# EAGLE design BMS_MCUV1.1 (EAGLE 9.2.2)

## Sheet 1 of 2
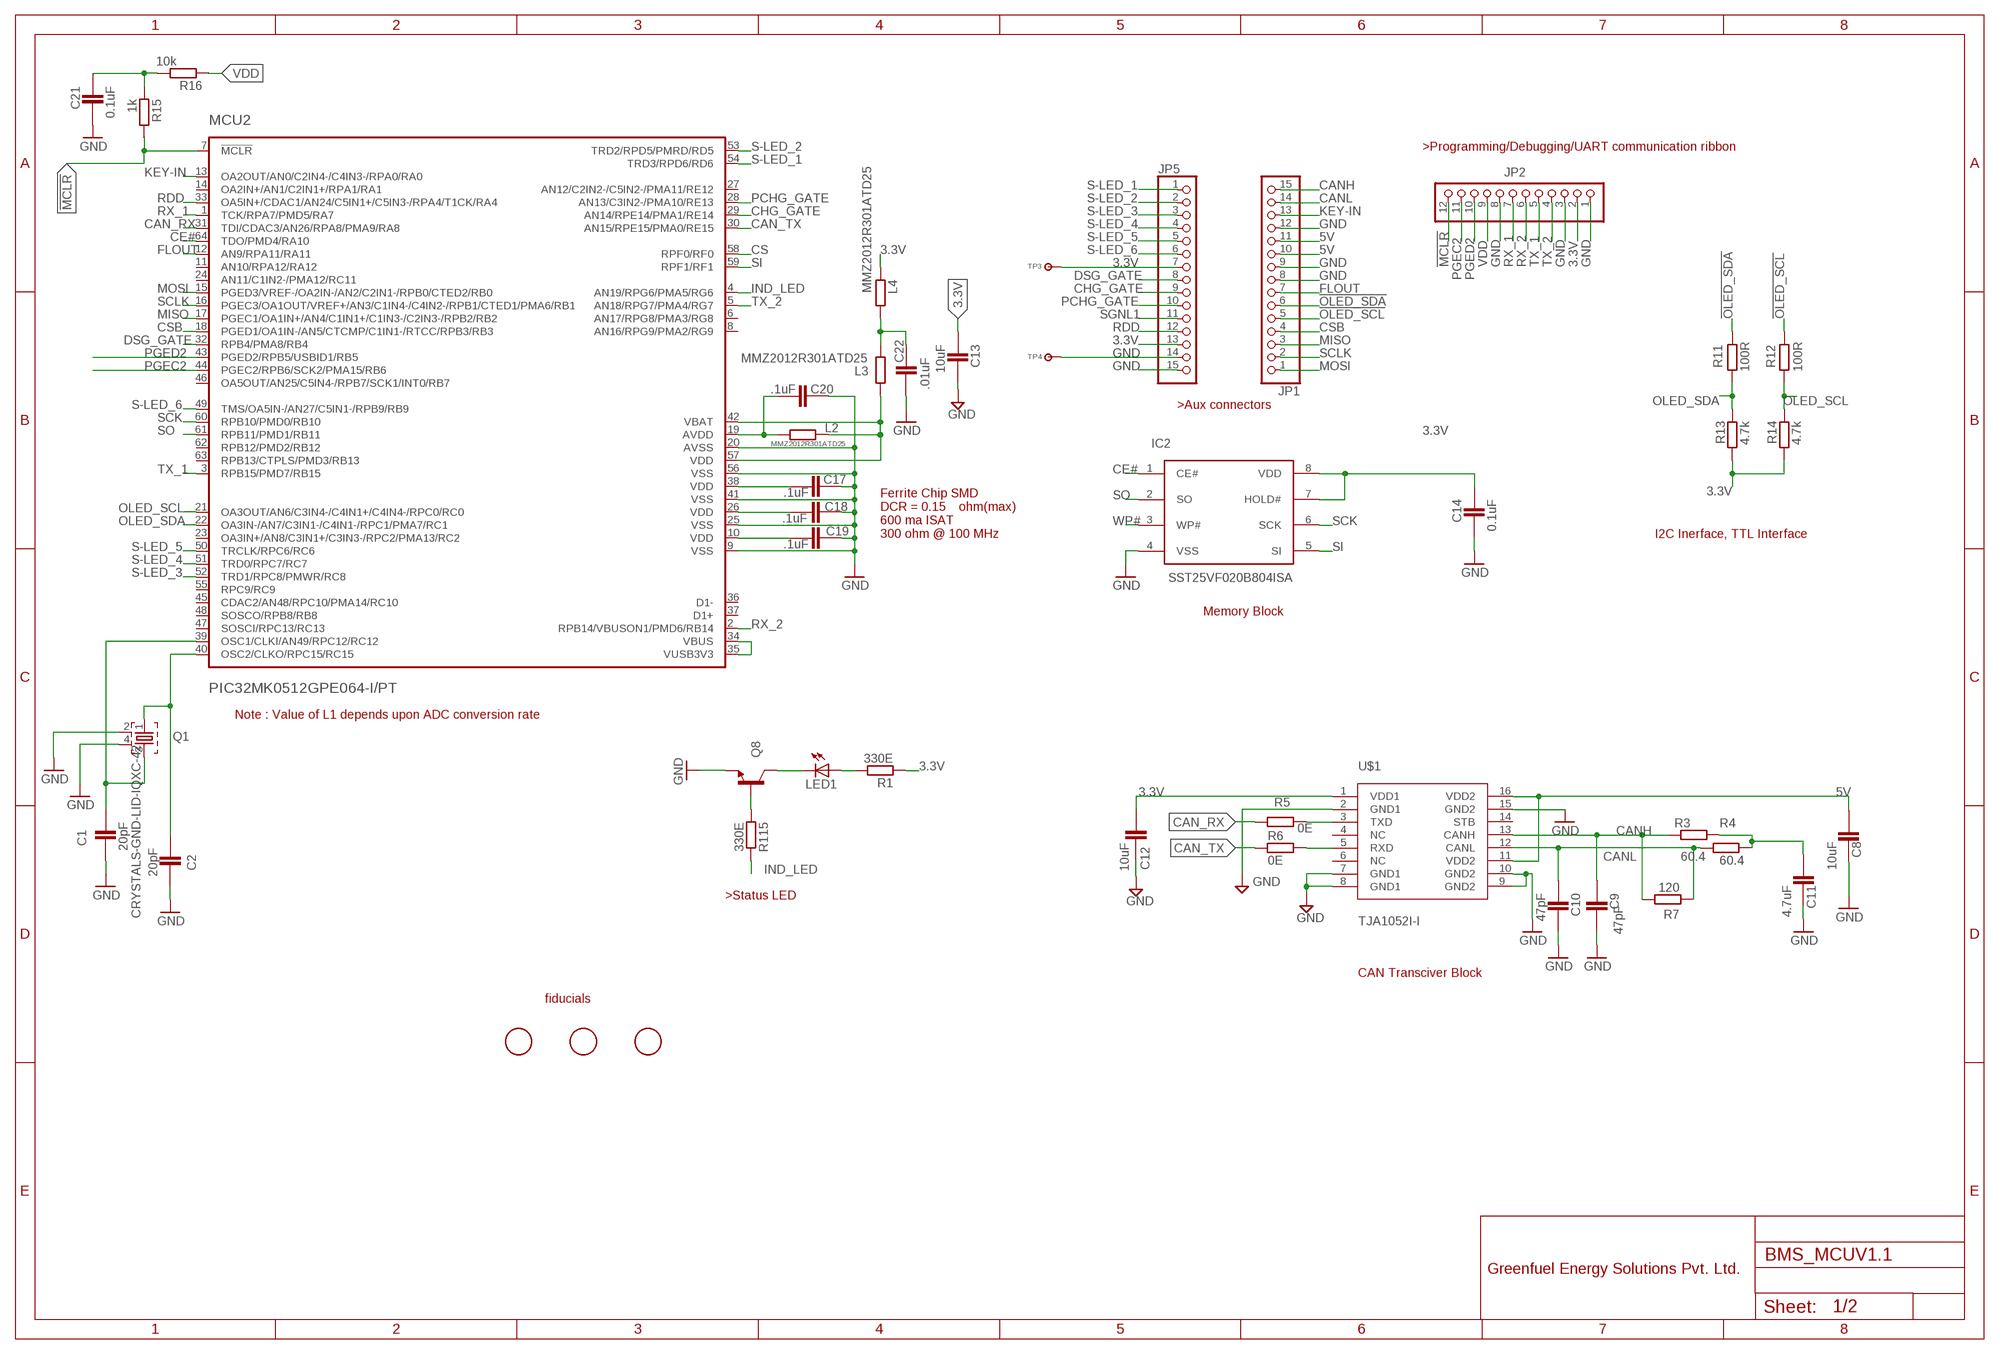
[diagram p0: schematic, sheet 1]

### Parts
C1  20pF  CAPACITOR_0402  [CAPC1005X60N]
C2  20pF  CAPACITOR_0402  [CAPC1005X60N]
C8  10uF  CAPACITOR_0402  [CAPC1005X60N]
C9  47pF  CAPACITOR_0402  [CAPC1005X60N]
C10  47pF  CAPACITOR_0402  [CAPC1005X60N]
C11  4.7uF  CAPACITOR_0402  [CAPC1005X60N]
C12  10uF  CAPACITOR_0402  [CAPC1005X60N]
C13  10uF  CAPACITOR_0402  [CAPC1005X60N]
C14  0.1uF  CAPACITOR_0402  [CAPC1005X60N]
C17  .1uF  CAPACITOR_0402  [CAPC1005X60N]
C18  .1uF  CAPACITOR_0402  [CAPC1005X60N]
C19  .1uF  CAPACITOR_0402  [CAPC1005X60N]
C20  .1uF  CAPACITOR_0402  [CAPC1005X60N]
C21  0.1uF  CAPACITOR_0402  [CAPC1005X60N]
C22  .01uF  CAPACITOR_0402  [CAPC1005X60N]
IC2  SST25VF020B804ISA  [SOIC127P600X175-8N]
JP1  PINHD-1X15  [1X15]
JP2  PINHD-1X12  [1X12X2]
JP5  PINHD-1X15  [1X15]
L2  MMZ2012R301ATD25  RESISTOR_0805  [RESC2012X70N]
L3  MMZ2012R301ATD25  RESISTOR_0805  [RESC2012X70N]
L4  MMZ2012R301ATD25  RESISTOR_0805  [RESC2012X70N]
LED1  LEDCHIP-LED0603  [CHIP-LED0603]
MCU2  PIC32MK0512GPE064-I/PT  [TQFP-64-I/PT]
Q1  CRYSTALS-GND-LID-IQXC-42  [1.4X1.2-4-PAD]
Q8  NPN_SOT-23  [SOT95P280X135-3N]
R1  330E  RESISTOR_0402  [RESC1005X40AN]
R3  60.4  RESISTOR_0402  [RESC1005X40AN]
R4  60.4  RESISTOR_0402  [RESC1005X40AN]
R5  0E  RESISTOR_0402  [RESC1005X40AN]
R6  0E  RESISTOR_0402  [RESC1005X40AN]
R7  120  RESISTOR_0402  [RESC1005X40AN]
R11  100R  RESISTOR_0402  [RESC1005X40AN]
R12  100R  RESISTOR_0402  [RESC1005X40AN]
R13  4.7k  RESISTOR_0402  [RESC1005X40AN]
R14  4.7k  RESISTOR_0402  [RESC1005X40AN]
R15  1k  RESISTOR_0402  [RESC1005X40AN]
R16  10k  RESISTOR_0402  [RESC1005X40AN]
R115  330E  RESISTOR_0402  [RESC1005X40AN]
TP3  TP-SMD60  [TP-SMD60]
TP4  TP-SMD60  [TP-SMD60]
U$1  TJA1052I-I  [SOT162-1]
U$2  FIDUCIAL  [FIDUCIAL_1MM]
U$3  FIDUCIAL  [FIDUCIAL_1MM]
U$4  FIDUCIAL  [FIDUCIAL_1MM]

### Nets
3.3V: C12.1 C13.1 C14.1 IC2.7(HOLD#) IC2.8(VDD) JP2.2 JP5.7 JP5.13 L4.1 R1.1 R13.1 R14.1 TP3.P$1 U$1.1(VDD1)
5V: C8.1 JP1.10 JP1.11 U$1.11(VDD2) U$1.16(VDD2)
!MCLR: JP2.12 MCU2.7(!MCLR) R15.2
!OLED_SCL: JP1.5 R12.2
!OLED_SDA: JP1.6 R11.2
AVDD: C20.1 L2.1 MCU2.19(AVDD)
CAN_RX: MCU2.31(TDI/CDAC3/AN26/RPA8/PMA9/RA8) R5.1
CAN_TX: MCU2.30(AN15/RPE15/PMA0/RE15) R6.1
CANH: C9.1 JP1.15 R3.1 R7.2 U$1.13(CANH)
CANL: C10.1 JP1.14 R4.1 R7.1 U$1.12(CANL)
CE#: IC2.1(CE#) MCU2.64(TDO/PMD4/RA10)
CHG_GATE: JP5.9 MCU2.29(AN14/RPE14/PMA1/RE14)
CS: MCU2.58(RPF0/RF0)
CSB: JP1.4 MCU2.18(PGED1/OA1IN-/AN5/CTCMP/C1IN1-/RTCC/RPB3/RB3)
DSG_GATE: JP5.8 MCU2.32(RPB4/PMA8/RB4)
FLOUT: JP1.7 MCU2.12(AN9/RPA11/RA11)
GND: C1.2 C2.2 C8.2 C9.2 C10.2 C11.2 C12.2 C13.2 C14.2 C17.2 C18.2 C19.2 C20.2 C21.2 C22.1 IC2.4(VSS) JP1.8 JP1.9 JP1.12 JP2.1 JP2.3 JP2.8 JP5.14 JP5.15 MCU2.9(VSS) MCU2.20(AVSS) MCU2.25(VSS) MCU2.41(VSS) MCU2.56(VSS) Q1.2 Q1.4 Q8.2(E) TP4.P$1 U$1.2(GND1) U$1.7(GND1) U$1.8(GND1) U$1.9(GND2) U$1.10(GND2) U$1.15(GND2)
IND_LED: MCU2.4(AN19/RPG6/PMA5/RG6) R115.2
KEY-IN: JP1.13 MCU2.13(OA2OUT/AN0/C2IN4-/C4IN3-/RPA0/RA0)
MISO: JP1.3 MCU2.17(PGEC1/OA1IN+/AN4/C1IN1+/C1IN3-/C2IN3-/RPB2/RB2)
MOSI: JP1.1 MCU2.15(PGED3/VREF-/OA2IN-/AN2/C2IN1-/RPB0/CTED2/RB0)
N$1: C1.1 MCU2.39(OSC1/CLKI/AN49/RPC12/RC12) Q1.3
N$2: C2.1 MCU2.40(OSC2/CLKO/RPC15/RC15) Q1.1
N$3: R5.2 U$1.3(TXD)
N$5: LED1.A R1.2
N$6: R6.2 U$1.5(RXD)
N$7: Q8.1(B) R115.1
N$8: LED1.C Q8.3(C)
N$33: C22.2 L3.2 L4.2
N$34: C21.1 R15.1 R16.2
N$82: MCU2.34(VBUS) MCU2.35(VUSB3V3)
OLED_SCL: MCU2.21(OA3OUT/AN6/C3IN4-/C4IN1+/C4IN4-/RPC0/RC0) R12.1 R14.2
OLED_SDA: MCU2.22(OA3IN-/AN7/C3IN1-/C4IN1-/RPC1/PMA7/RC1) R11.1 R13.2
PCHG_GATE: JP5.10 MCU2.28(AN13/C3IN2-/PMA10/RE13)
PGEC2: JP2.11 MCU2.44(PGEC2/RPB6/SCK2/PMA15/RB6)
PGED2: JP2.10 MCU2.43(PGED2/RPB5/USBID1/RB5)
R4/R3/C11: C11.1 R3.2 R4.2
RDD: JP5.12 MCU2.33(OA5IN+/CDAC1/AN24/C5IN1+/C5IN3-/RPA4/T1CK/RA4)
RX_1: JP2.7 MCU2.1(TCK/RPA7/PMD5/RA7)
RX_2: JP2.6 MCU2.2(RPB14/VBUSON1/PMD6/RB14)
S-LED_1: JP5.1 MCU2.54(TRD3/RPD6/RD6)
S-LED_2: JP5.2 MCU2.53(TRD2/RPD5/PMRD/RD5)
S-LED_3: JP5.3 MCU2.52(TRD1/RPC8/PMWR/RC8)
S-LED_4: JP5.4 MCU2.51(TRD0/RPC7/RC7)
S-LED_5: JP5.5 MCU2.50(TRCLK/RPC6/RC6)
S-LED_6: JP5.6 MCU2.49(TMS/OA5IN-/AN27/C5IN1-/RPB9/RB9)
SCK: IC2.6(SCK) MCU2.60(RPB10/PMD0/RB10)
SCLK: JP1.2 MCU2.16(PGEC3/OA1OUT/VREF+/AN3/C1IN4-/C4IN2-/RPB1/CTED1/PMA6/RB1)
SGNL1: JP5.11
SI: IC2.5(SI) MCU2.59(RPF1/RF1)
SO: IC2.2(SO) MCU2.61(RPB11/PMD1/RB11)
TX_1: JP2.5 MCU2.3(RPB15/PMD7/RB15)
TX_2: JP2.4 MCU2.5(AN18/RPG7/PMA4/RG7)
VDD: C17.1 C18.1 C19.1 JP2.9 L2.2 L3.1 MCU2.10(VDD) MCU2.26(VDD) MCU2.38(VDD) MCU2.42(VBAT) MCU2.57(VDD) R16.1
WP#: IC2.3(WP#)
Unconnected: MCU2.6(AN17/RPG8/PMA3/RG8) MCU2.8(AN16/RPG9/PMA2/RG9) MCU2.11(AN10/RPA12/RA12) MCU2.14(OA2IN+/AN1/C2IN1+/RPA1/RA1) MCU2.23(OA3IN+/AN8/C3IN1+/C3IN3-/RPC2/PMA13/RC2) MCU2.24(AN11/C1IN2-/PMA12/RC11) MCU2.27(AN12/C2IN2-/C5IN2-/PMA11/RE12) MCU2.36(D1-) MCU2.37(D1+) MCU2.45(CDAC2/AN48/RPC10/PMA14/RC10) MCU2.46(OA5OUT/AN25/C5IN4-/RPB7/SCK1/INT0/RB7) MCU2.47(SOSCI/RPC13/RC13) MCU2.48(SOSCO/RPB8/RB8) MCU2.55(RPC9/RC9) MCU2.62(RPB12/PMD2/RB12) MCU2.63(RPB13/CTPLS/PMD3/RB13) U$1.4(NC) U$1.6(NC) U$1.14(STB)

### Notes on the sheet
- >Programming/Debugging/UART communication ribbon
- >Aux connectors
- Ferrite Chip SMD
  DCR = 0.15ȍ ohm(max)
  600 ma ISAT
  300 ohm @ 100 MHz
- I2C Inerface, TTL Interface
- Memory Block
- Note : Value of L1 depends upon ADC conversion rate
- >Status LED
- CAN Transciver Block
- fiducials
- Greenfuel Energy Solutions Pvt. Ltd.

## Sheet 2 of 2

## Library data of the parts
C1 C2 C8-C14 C17-C22 = ipc-7351-capacitor:CAPACITOR_
IC2 = GreenFuel:SST25VF020B804ISA
JP1 JP5 = GreenFuel:PINHD-1X15: PIN HEADER
JP2 = GreenFuel:PINHD-1X12: PIN HEADER
L2-L4 R1 R3-R7 R11-R16 R115 = ipc-7351-resistor:RESISTOR_
LED1 = adafruit:LED: LED OSRAM: - CHIPLED LG R971, LG N971, LY N971, LG Q971, LY Q971, LO R971, LY R971 LH N974, LH R974 LS Q976, LO Q976, LY Q976 LO Q996 - Hyper CHIPLED LW Q18S LB Q993, LB Q99A, LB R99A - SideLED LS A670, LO A670, LY A670, LG A670, LP A670 LB A673, LV A673, LT A673, LW A673 LH A674 LY A675 LS A676, LA A676, LO A676, LY A676, LW A676 LS A679, LY A679, LG A679 - Hyper Micro SIDELED® LS Y876, LA Y876, LO Y876, LY Y876 LT Y87S - SmartLED LW L88C, LW L88S LB L89C, LB L89S, LG L890 LS L89K, LO L89K, LY L89K LS L896, LA L896, LO L896, LY L896 - TOPLED LS T670, LO T670, LY T670, LG T670, LP T670 LSG T670, LSP T670, LSY T670, LOP T670, LYG T670 LG T671, LOG T671, LSG T671 LB T673, LV T673, LT T673, LW T673 LH T674 LS T676, LA T676, LO T676, LY T676, LB T676, LH T676, LSB T676, LW T676 LB T67C, LV T67C, LT T67C, LS T67K, LO T67K, LY T67K, LW E67C LS E67B, LA E67B, LO E67B, LY E67B, LB E67C, LV E67C, LT E67C LW T67C LS T679, LY T679, LG T679 LS T770, LO T770, LY T770, LG T770, LP T770 LB T773, LV T773, LT T773, LW T773 LH T774 LS E675, LA E675, LY E675, LS T675 LS T776, LA T776, LO T776, LY T776, LB T776 LHGB T686 LT T68C, LB T68C - Hyper Mini TOPLED® LB M676 - Mini TOPLED Santana® LG M470 LS M47K, LO M47K, LY M47K Source: http://www.osram.convergy.de/
MCU2 = GreenFuel:PIC32MK0512GPE064-I/PT
Q1 = GreenFuel:CRYSTALS-GND-LID: CRYSTALS WITH CAN GROUNDED
Q8 = ipc-7351-transistor:NPN_
TP3 TP4 = simpa:TP
U$1 = GreenFuel:TJA1052I: TJA1052i - Galvanically isolated high-speed CAN transceiver Specification : Type : SOT162-1 Manufacture : NXP Manufacture PN: TJA1052i Certifications: ISO 11898-2:2003 compliant Suitable for use in 12 V and 24 V systems; compatible with 3 V to 5 V microcontrollers Supporting Material TJA1052i Datasheet <https://www.nxp.com/docs/en/data-sheet/TJA1052I.pdf>
U$2-U$4 = adafruit:FIDUCIAL: For use by pick and place machines to calibrate the vision/machine, 1mm By microbuilder.eu

## Board
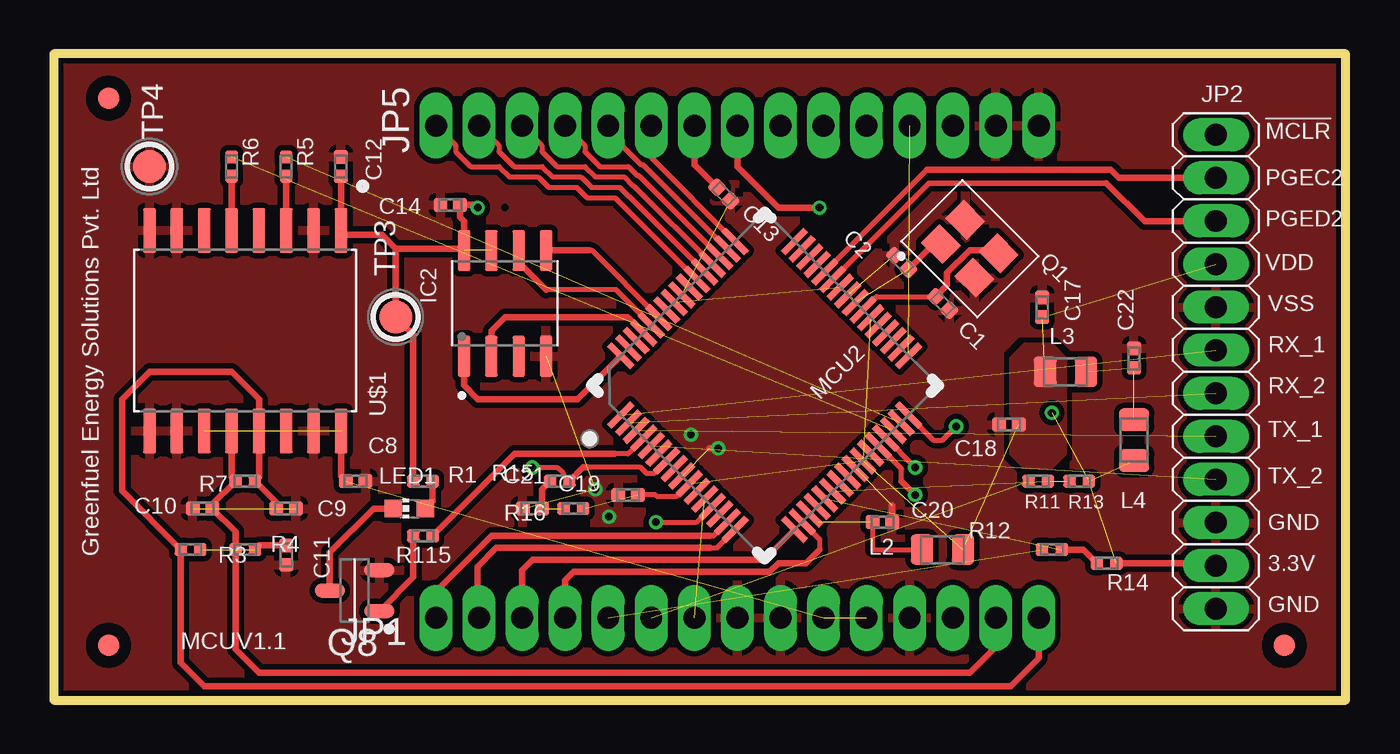
[diagram p1: board, top side]
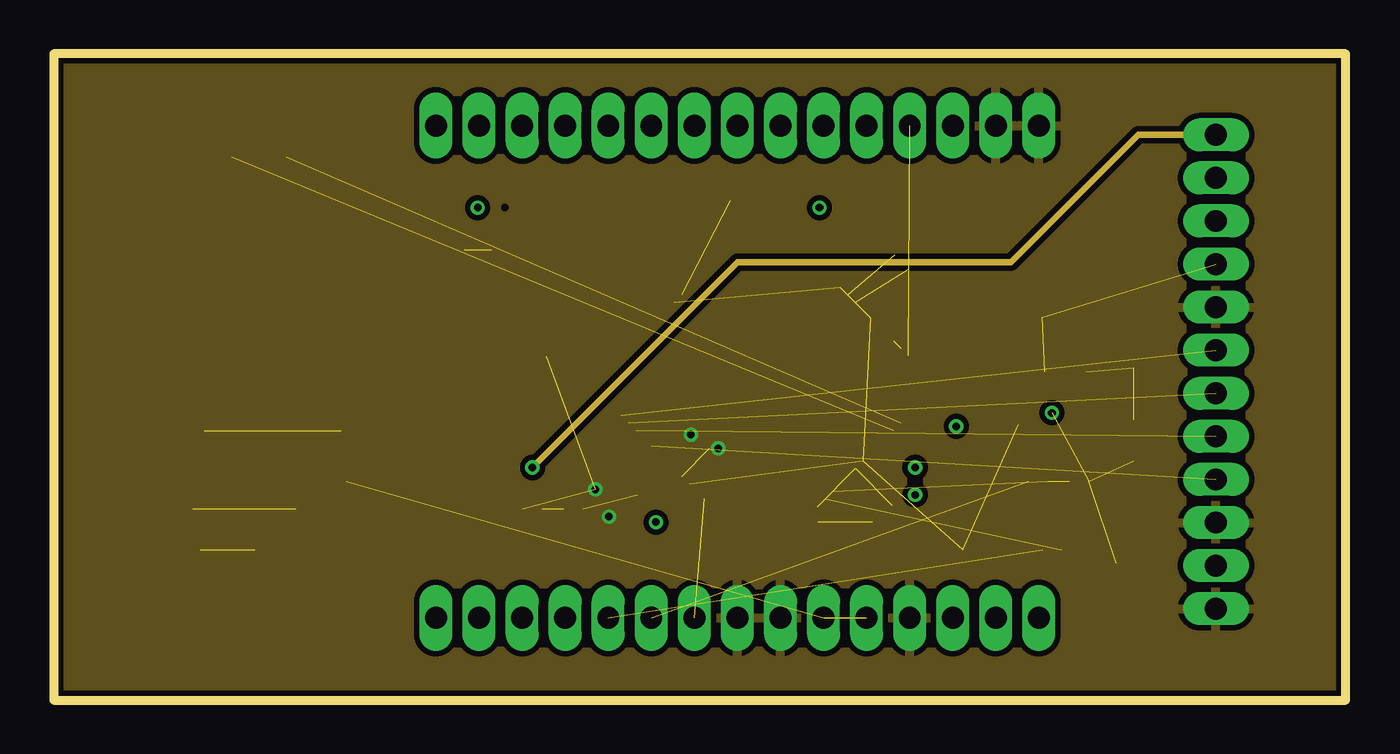
[diagram p2: board, inner layer GND]
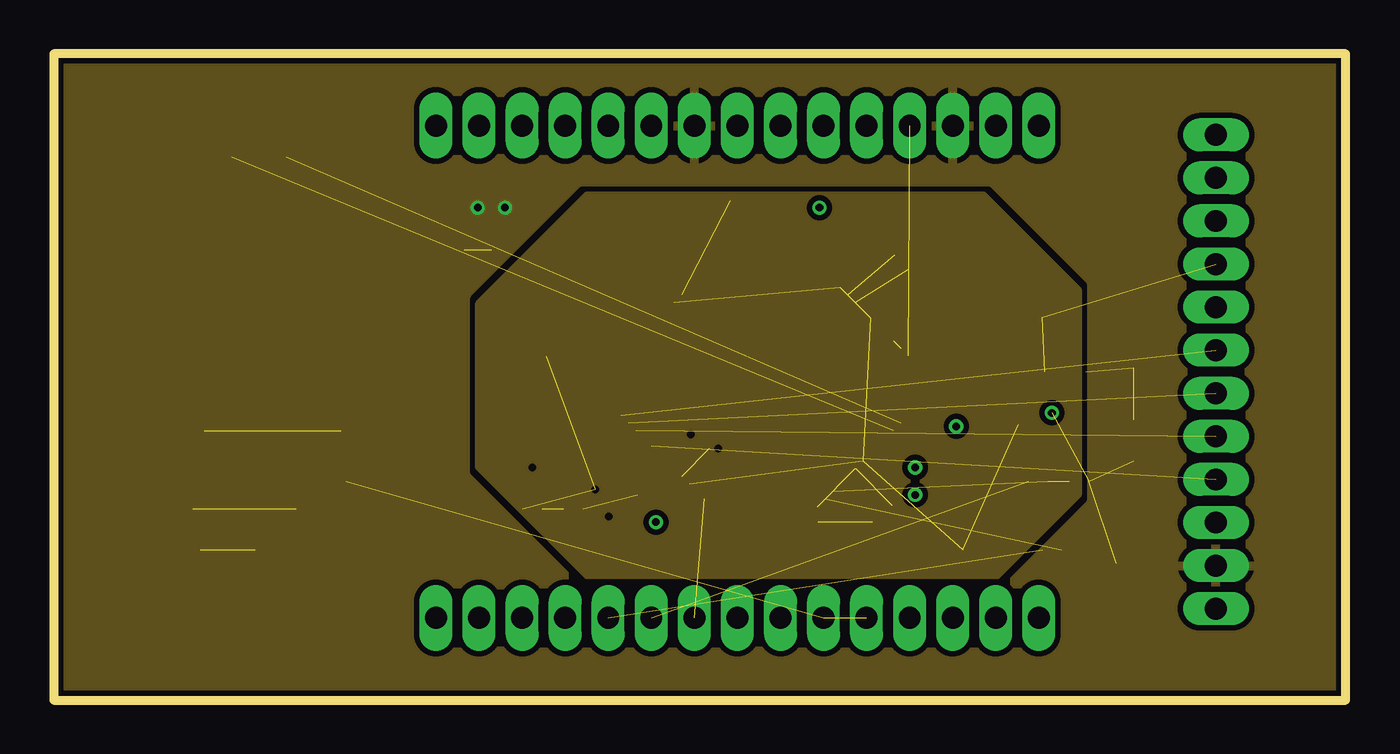
[diagram p3: board, inner layer SUPPLY]
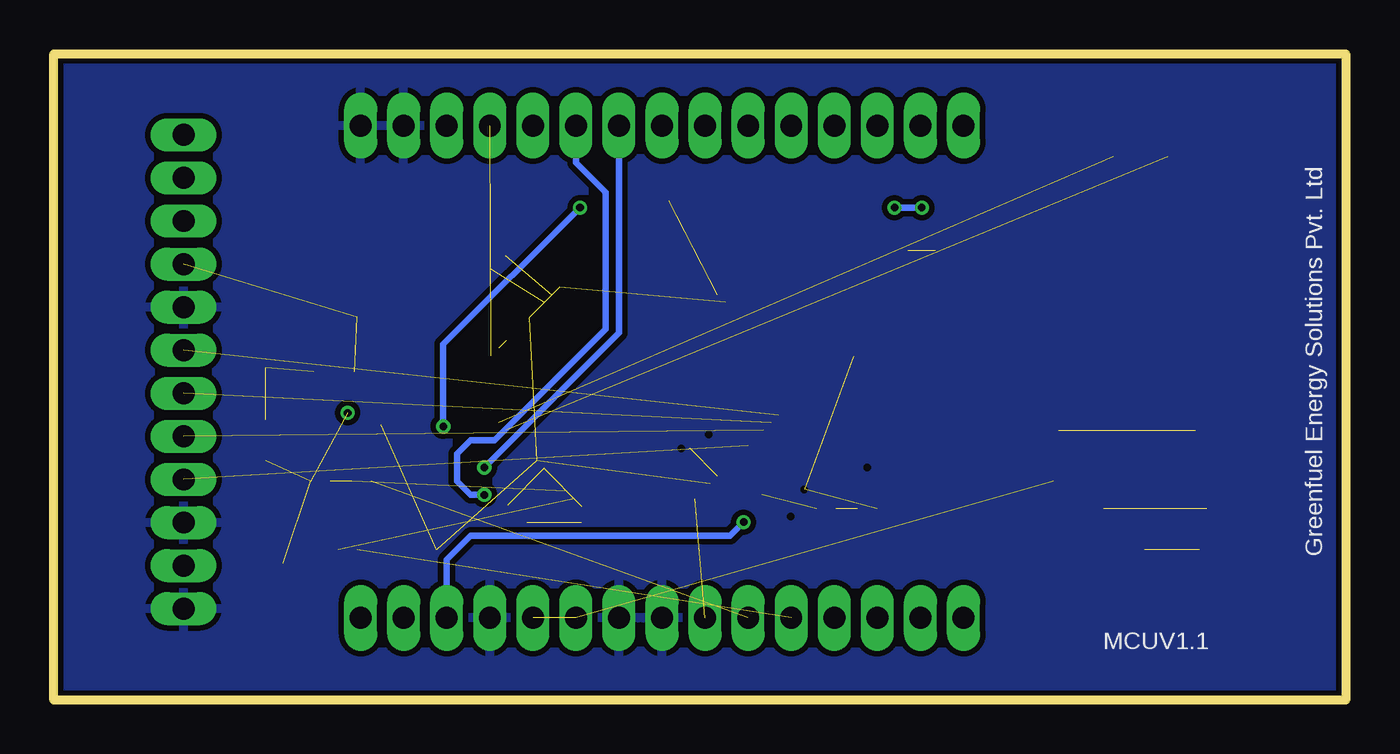
[diagram p4: board, bottom side, seen from below]

Size 60 x 30 mm. Coordinates in mm from the lower left corner, seen from the top.
Outline: 0,0 60,0 60,30 0,30 0,0
Copper layers ([2:1+2*15+16:15]): Top 0.035mm / dielectric 0.09238125mm / GND 0.035mm / dielectric 1.2304mm / SUPPLY 0.035mm / dielectric 0.09238125mm / Bottom 0.035mm
Design rules "default *": minimum track width 6mil, minimum drill 12mil, track to track 10mil, track to pad 8mil, pad to pad 6mil, via to via 10mil, smd to smd 0mil, copper to edge 10mil, drill to drill 10mil, minimum pad ring 10mil, minimum via ring 6mil, stop-mask expansion 2mil, vias tented up to drill 100mil, thermal gap 10mil

### Footprints (pad centres in the part's own frame; a part is rotated, then mirrored left to right if it is on the bottom)
CAPC1005X60N = smd 0.65 x 0.65: 1 -0.45,0; 2 0.45,0
SOIC127P600X175-8N = smd 1.9 x 0.6: 1 -2.455,1.905; 2 -2.455,0.635; 3 -2.455,-0.635; 4 -2.455,-1.905; 5 2.455,-1.905; 6 2.455,-0.635; 7 2.455,0.635; 8 2.455,1.905
1X15 = drill 1.016 long: 1 -14,0; 2 -12,0; 3 -10,0; 4 -8,0; 5 -6,0; 6 -4,0; 7 -2,0; 8 0,0; 9 2,0; 10 4,0; 11 6,0; 12 8,0; 13 10,0; 14 12,0; 15 14,0
1X12X2 = drill 1.016 long: 1 -11,0; 2 -9,0; 3 -7,0; 4 -5,0; 5 -3,0; 6 -1,0; 7 1,0; 8 3,0; 9 5,0; 10 7,0; 11 9,0; 12 11,0
RESC2012X70N = smd 1.05 x 1.4: 1 -0.95,0; 2 0.95,0
CHIP-LED0603 = smd 0.8 x 0.8: A 0,-0.75; C 0,0.75
TQFP-64-I/PT = smd 1.5 x 0.3: 1 -5.7,3.75; 2 -5.7,3.25; 3 -5.7,2.75; 4 -5.7,2.25; 5 -5.7,1.75; 6 -5.7,1.25; 7 -5.7,0.75; 8 -5.7,0.25; 9 -5.7,-0.25; 10 -5.7,-0.75; 11 -5.7,-1.25; 12 -5.7,-1.75; 13 -5.7,-2.25; 14 -5.7,-2.75; 15 -5.7,-3.25; 16 -5.7,-3.75; 33 5.7,-3.75; 34 5.7,-3.25; 35 5.7,-2.75; 36 5.7,-2.25; 37 5.7,-1.75; 38 5.7,-1.25; 39 5.7,-0.75; 40 5.7,-0.25; 41 5.7,0.25; 42 5.7,0.75; 43 5.7,1.25; 44 5.7,1.75; 45 5.7,2.25; 46 5.7,2.75; 47 5.7,3.25; 48 5.7,3.75 | smd 0.3 x 1.5: 17 -3.75,-5.7; 18 -3.25,-5.7; 19 -2.75,-5.7; 20 -2.25,-5.7; 21 -1.75,-5.7; 22 -1.25,-5.7; 23 -0.75,-5.7; 24 -0.25,-5.7; 25 0.25,-5.7; 26 0.75,-5.7; 27 1.25,-5.7; 28 1.75,-5.7; 29 2.25,-5.7; 30 2.75,-5.7; 31 3.25,-5.7; 32 3.75,-5.7; 49 3.75,5.7; 50 3.25,5.7; 51 2.75,5.7; 52 2.25,5.7; 53 1.75,5.7; 54 1.25,5.7; 55 0.75,5.7; 56 0.25,5.7; 57 -0.25,5.7; 58 -0.75,5.7; 59 -1.25,5.7; 60 -1.75,5.7; 61 -2.25,5.7; 62 -2.75,5.7; 63 -3.25,5.7; 64 -3.75,5.7
1.4X1.2-4-PAD = smd 1.4 x 1.2: 1 -1.1,-0.8; 2 1.1,-0.8; 3 1.1,0.8; 4 -1.1,0.8
SOT95P280X135-3N = smd 1.4 x 0.65: 1 -1.15,0.95; 2 -1.15,-0.95; 3 1.15,0
RESC1005X40AN = smd 0.6 x 0.6: 1 -0.45,0; 2 0.45,0
TP-SMD60 = smd 1.524 x 1.524: P$1 0,0
SOT162-1 = smd 2.05 x 0.6: 1 -4.655,4.445; 2 -4.655,3.175; 3 -4.655,1.905; 4 -4.655,0.635; 5 -4.655,-0.635; 6 -4.655,-1.905; 7 -4.655,-3.175; 8 -4.655,-4.445; 9 4.655,-4.445; 10 4.655,-3.175; 11 4.655,-1.905; 12 4.655,-0.635; 13 4.655,0.635; 14 4.655,1.905; 15 4.655,3.175; 16 4.655,4.445
FIDUCIAL_1MM = smd 1 x 1: 1 0,0

### Placement (x,y rotation side)
C1  41.27,18.41 315 top
C2  39.37,20.32 135 top
C8  14.02,10.16 0 top
C9  10.79,8.89 0 top
C10  6.91,8.89 180 top
C11  10.79,6.73 270 top
C12  13.34,24.77 90 top
C13  31.11,23.5 315 top
C14  18.41,22.99 180 top
C17  45.91,18.23 90 top
C18  44.36,12.79 180 top
C19  26.67,9.53 180 top
C20  38.48,8.26 0 top
C21  22.23,8.89 180 top
C22  50.16,15.88 270 top
IC2  20.95,18.41 90 top
JP1  31.75,3.81 0 top
JP2  53.98,15.24 90 top
JP5  31.75,26.67 0 top
L2  41.27,6.99 0 top
L3  46.99,15.24 0 top
L4  50.16,12.06 90 top
LED1  16.51,8.89 90 top
MCU2  33.02,14.61 45 top
Q1  42.55,20.95 315 top
Q8  13.97,5.08 180 top
R1  17.14,10.16 0 top
R3  6.35,6.99 0 top
R4  8.89,6.99 0 top
R5  10.79,24.77 270 top
R6  8.26,24.77 270 top
R7  8.89,10.16 0 top
R11  45.72,10.16 180 top
R12  46.35,6.99 180 top
R13  47.62,10.16 180 top
R14  48.9,6.35 180 top
R15  23.5,10.16 0 top
R16  24.13,8.89 180 top
R115  17.14,7.62 0 top
TP3  15.88,17.78 0 top
TP4  4.45,24.77 90 top
U$1  8.89,17.14 270 top
U$2  2.54,2.54 0 top
U$3  2.54,27.94 0 top
U$4  57.15,2.54 0 top

### Tracks (layer width: path | path; a pad name or v marks a point on that pad's centre or on a via)
3.3V  (via drill 0.35, 0.35 layers 15-16)  (4 unrouted)
  Top 0.305: 15.88,20.95 15.24,21.59 13.54,21.59 U$1.1 C12.1 | 15.88,20.95 TP3.P$1 16.7,16.96 R1.1 | 15.88,20.95 18.96,20.95 IC2.8 19.05,22.23 18.86,22.41 C14.1 19.56,22.99 v19.68,22.86 | JP5.7 29.75,24.86 C13.1 | R14.1 53.87,6.35 JP2.2
  Bottom 0.305: v19.68,22.86 v20.95,22.86
  other vias: 46.35,13.34
  pour SUPPLY (rank 6): 0,30 60,30 60,0 0,0
5V  (3 unrouted)
  Top 0.305: U$1.16 13.34,10.4 C8.1
!MCLR  (via drill 0.35 layers 1-2)
  Top 0.229: 24.77,10.79 27.26,10.79 27.55,10.5 27.86,10.5 MCU2.7 | R15.2 23.66,10.44 23.66,10.52 23.41,10.78 22.24,10.78 v22.23,10.79
  Top 0.305: 24.77,10.79 24.58,10.79 R15.2
  GND 0.305: v22.23,10.79 31.75,20.32 44.45,20.32 50.37,26.24 JP2.12
!OLED_SCL  (1 unrouted)
!OLED_SDA  (1 unrouted)
AVDD  (1 unrouted)
  Top 0.229: MCU2.19 35.48,8.26 | C20.1 38.03,6.99 L2.1
CAN_RX  (1 unrouted)
CAN_TX  (1 unrouted)
CANH
  Top 0.305: JP1.15 45.75,1.94 44.45,0.64 6.99,0.64 5.9,1.72 R3.1 3.17,9.71 3.17,13.97 4.45,15.24 8.26,15.24 9.53,13.97 U$1.13 9.53,10.35 R7.2 10.35,9.15 C9.1
CANL
  Top 0.305: JP1.14 43.75,2.48 42.55,1.27 9.53,1.27 8.44,2.35 R4.1 8.44,7.81 C10.1 7.36,9.08 R7.1 8.26,10.35 U$1.12
CE#
  Top 0.229: MCU2.64
  Top 0.305: IC2.1 19.05,14.61 19.68,13.97 24.32,13.97 MCU2.64
CHG_GATE  (via drill 0.35)
  Top 0.229: v40.01,10.79 40.01,10.8 MCU2.29
  Bottom 0.305: JP5.9 33.75,17.05 v40.01,10.79
CSB
  Top 0.229: MCU2.18 35.56,7.47 35.56,6.99
  Top 0.305: JP1.4 23.75,5.56 24.13,5.94 33.25,5.94 33.66,6.35 34.92,6.35 35.56,6.99
DSG_GATE  (via drill 0.35)
  Top 0.229: MCU2.32 40.86,12.06 41.27,12.06 v41.91,12.7
  Top 0.305: JP5.8 31.75,24.77 33.66,22.86 v35.56,22.86
  Bottom 0.305: v35.56,22.86 41.91,16.51 v41.91,12.7
FLOUT  (1 unrouted)
GND  (via drill 0.35 layers 1-2)  (8 unrouted)
  Top 0.305: 38.93,9.05 C20.2 | 30.45,11.68 v30.86,11.68
  other vias: 25.78,8.51 25.15,9.78 29.59,12.32
  pour Top (rank 6): 0,29.97 59.94,29.97 59.94,0 0,0
  pour GND: 0,29.97 59.94,29.97 59.94,0 0,0
  pour Bottom (rank 6): 0,29.97 59.94,29.97 59.94,0 0,0
IND_LED
  Top 0.229: MCU2.4 26.66,11.43 26.04,11.43
  Top 0.305: R115.2 21.41,11.43 26.04,11.43
KEY-IN  (via drill 0.35)
  Top 0.229: v27.96,8.26 29.85,8.26 MCU2.13
  Bottom 0.305: JP1.13 41.75,6.51 40.64,7.62 28.59,7.62 v27.96,8.26
MISO
  Top 0.229: 32.98,6.5 MCU2.17
  Top 0.305: JP1.3 21.75,6.03 22.23,6.5 32.98,6.5
MOSI
  Top 0.229: MCU2.15 30.63,7.62 30.48,7.62
  Top 0.305: JP1.1 17.75,5.05 20.32,7.62 30.48,7.62
N$1
  Top 0.229: MCU2.39 38.21,18.73 C1.1
  Top 0.305: C1.1 41.48,19.26 41.48,19.83 42.54,20.89 43.74,20.89 Q1.3
N$2  (1 unrouted)
  Top 0.305: C2.1 40.85,21.17 Q1.1
N$3
  Top 0.305: U$1.3 R5.2
N$5
  Top 0.305: R1.2 17.59,9.22 LED1.A
N$6
  Top 0.305: R6.2 U$1.5
N$7
  Top 0.305: Q8.1 16.7,5.71 R115.1
N$8
  Top 0.305: Q8.3 12.82,6.87 14.85,8.89 LED1.C
N$33  (2 unrouted)
N$34  (1 unrouted)
  Top 0.305: R15.1 22.68,9.79 C21.1
N$82  (1 unrouted)
OLED_SCL  (1 unrouted)
  Top 0.305: R12.1 47.81,6.99 R14.2
OLED_SDA  (2 unrouted)
PCHG_GATE  (via drill 0.35)
  Top 0.229: 39.37,10.16 39.37,10.73 MCU2.28
  Top 0.305: v40.01,9.53 39.37,10.16
  Bottom 0.305: JP5.10 35.75,24.95 34.37,23.57 34.37,17.22 39.52,12.06 40.64,12.06 41.27,11.43 41.27,10.16 40.64,9.53 v40.01,9.53
PGEC2
  Top 0.229: MCU2.44 40.55,24.61
  Top 0.305: JP2.11 49.47,24.24 49.09,24.61 40.55,24.61
PGED2
  Top 0.229: MCU2.43 40.65,24 | 53.96,22.23 JP2.10
  Top 0.254: 40.65,24 48.9,24
  Top 0.305: 48.9,24 50.67,22.23 53.96,22.23
R4/R3/C11  (1 unrouted)
  Top 0.305: R4.2 9.54,7.18 C11.1
RDD  (1 unrouted)
RX_1  (1 unrouted)
RX_2  (1 unrouted)
S-LED_1
  Top 0.229: JP5.1 18.67,25.75 18.67,25.46 19.37,24.77 20.68,24.77 21.17,24.28 22.48,24.28 22.97,23.8 24.28,23.8 24.77,23.32 26.08,23.32 MCU2.54
S-LED_2
  Top 0.229: MCU2.53 26.72,23.38 26.7,23.38 26.28,23.8 24.97,23.8 24.48,24.28 23.17,24.28 22.68,24.77 21.37,24.77 20.67,25.46 20.67,25.75 JP5.2
S-LED_3
  Top 0.229: MCU2.52 26.94,23.86 26.9,23.86 26.48,24.28 25.17,24.28 24.68,24.77 23.37,24.77 22.67,25.46 22.67,25.75 JP5.3
S-LED_4
  Top 0.229: MCU2.51 27.17,24.35 27.1,24.35 26.68,24.77 25.37,24.77 24.67,25.46 24.67,25.75 JP5.4
S-LED_5
  Top 0.229: MCU2.50 27.39,24.83 27.3,24.83 25.75,26.38 JP5.5
S-LED_6
  Top 0.229: MCU2.49 27.75,25.18 JP5.6
SCK
  Top 0.229: MCU2.60 26.1,19.05 22.86,19.05
  Top 0.305: 22.86,19.05 21.59,20.32 IC2.6
SCLK
  Top 0.229: MCU2.16 31.64,7.89 30.81,7.06 30.48,7.06
  Top 0.305: JP1.2 19.68,3.88 19.68,6.2 20.55,7.06 30.48,7.06
SI
  Top 0.229: MCU2.59 24.99,20.87 24.85,20.87
  Top 0.305: 24.85,20.87 IC2.5
SO
  Top 0.229: 26.65,17.76 26.68,17.76 MCU2.61
  Top 0.305: IC2.2 20.32,17.14 20.95,17.78 26.63,17.78 26.65,17.76
TX_1  (1 unrouted)
TX_2  (1 unrouted)
VDD  (9 unrouted)
  Top 0.229: C19.1 27.94,9.53 28.02,9.44 28.92,9.44 MCU2.10
  pour SUPPLY: 19.68,18.41 24.77,23.5 43.18,23.5 47.62,19.05 47.62,9.53 43.81,5.71 24.77,5.71 19.68,10.79
  pour Top (no thermals): 45.09,16.51 46.35,16.51 46.99,15.88 46.99,11.43 46.35,10.79 45.09,10.79 44.45,11.43 44.45,15.88

### Text on the board
tPlace: !MCLR | Greenfuel Energy Solutions Pvt. Ltd | PGEC2 | PGED2 | VDD | VSS | RX_1 | RX_2 | TX_1 | TX_2 | GND | 3.3V | GND | MCUV1.1
bPlace: Greenfuel Energy Solutions Pvt. Ltd | MCUV1.1